# Altium project Reflow Oven Controller - Rev. A.PrjPcb
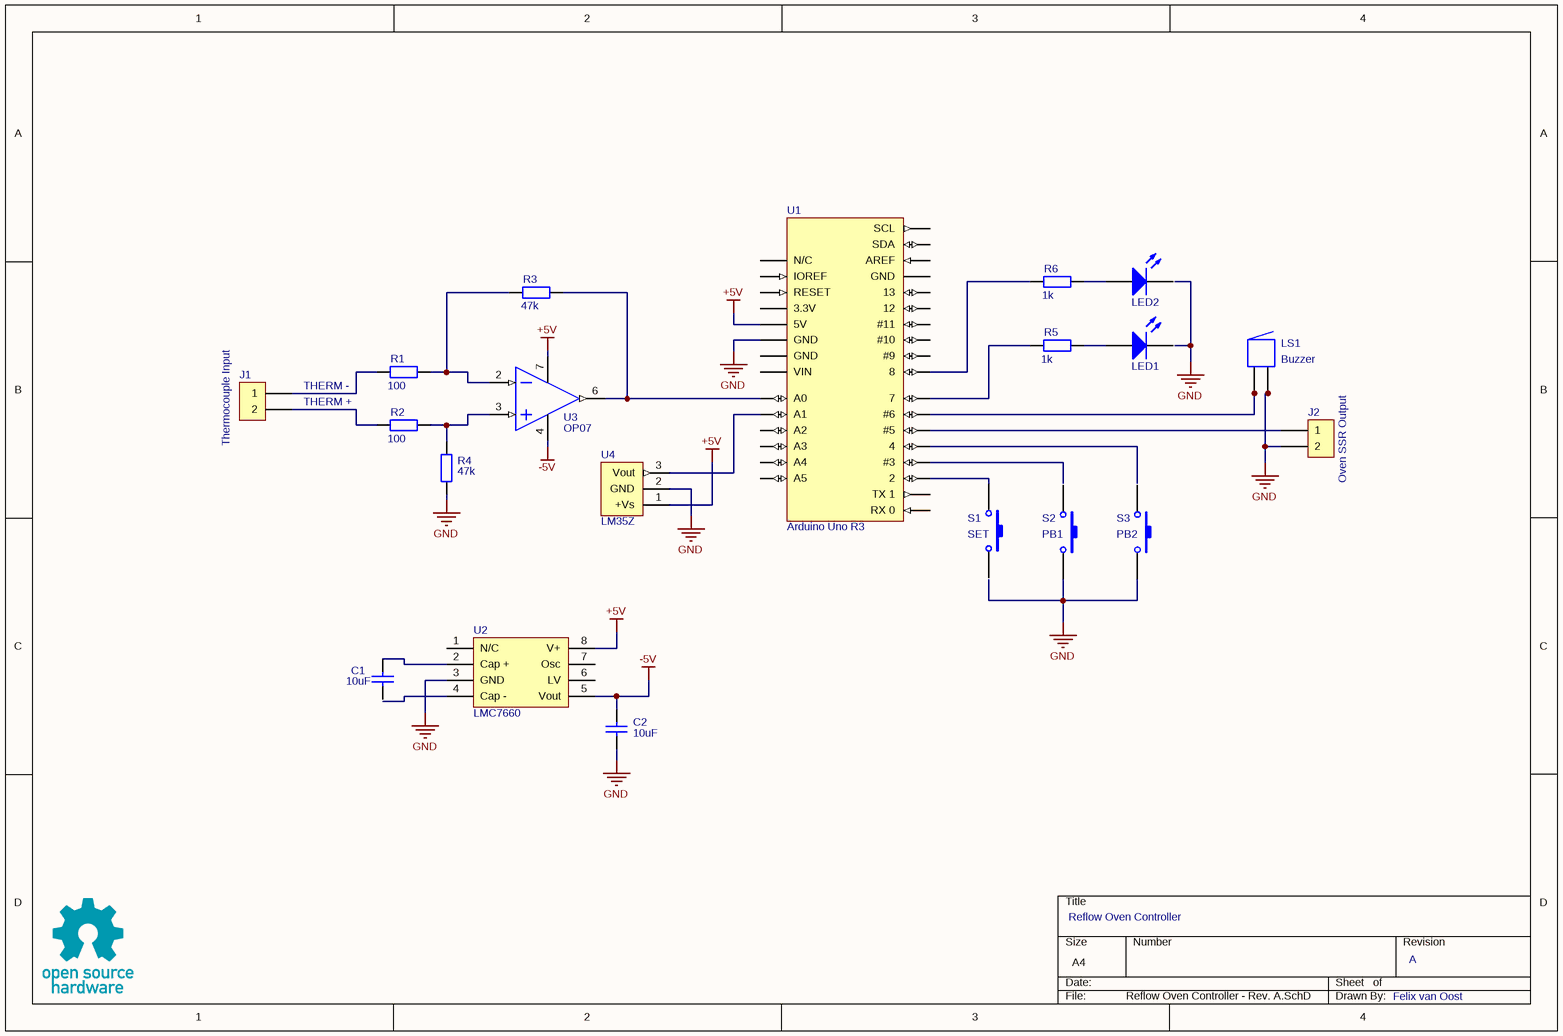
[diagram p0: Reflow Oven Controller - Rev. A.SchDoc]
1 sheet, 20 parts. Net scope: global (net labels, ports and power ports of the same name join across sheets).

## Sheet Reflow Oven Controller - Rev. A.SchDoc: Reflow Oven Controller
size A4; DrawnBy: Felix van Oost; Engineer: Felix van Oost; DocumentNumber: 1; Revision: A; ProjectName: Reflow Oven Controller

### Parts
C1  value 10uF  [RAD-0.3]
C2  value 10uF  [RAD-0.3]
D1  LED1  [LED-1]
D2  LED2  [LED-1]
J1  2-Pin Header  (value not drawn)
J2  2-Pin Header  (value not drawn)
LS1  Buzzer  [ABSM-1574]
R1  value 100  [AXIAL-0.4]
R2  value 100  [AXIAL-0.4]
R3  value 47k  [AXIAL-0.4]
R4  value 47k  [AXIAL-0.4]
R5  value 1k  [AXIAL-0.4]
R6  value 1k  [AXIAL-0.4]
S1  SET  [SPST-2]
S2  PB1  [SPST-2]
S3  PB2  [SPST-2]
U1  Arduino Uno R3
U2  LMC7660
U3  OP07
U4  LM35Z

### Nets
+5V: U1.5(5V) U2.8(V+) U3.7(V+) U4.1(+Vs)
-5V: C2.2 U2.5(Vout) U3.4(V-)
GND: C2.1 J2.2 LS1.2 LS1.2A R4.1 S2.2 S3.2 U1.6(GND) U2.3(GND) U4.2(GND)
NetC1_2: C1.2 U2.2(Cap_+)
NetD1_1: D1.1(A) R5.2
NetD2_1: D2.1(A) R6.2
NetJ1_1: J1.1 R1.1
NetJ1_2: J1.2 R2.1
NetJ2_1: J2.1 U1.20(#5)
NetLS1_1: LS1.1 LS1.1A U1.21(#6)
NetR1_2: R1.2 R3.1 U3.2(-In)
NetR2_2: R2.2 R4.2 U3.3(+In)
NetR3_2: R3.2 U1.9(A0) U3.6(OUT)
NetR5_1: R5.1 U1.22(7)
NetR6_1: R6.1 U1.23(8)
NetS1_1: S1.1 U1.17(2)
NetU1_10: U1.10(A1) U4.3(Vout)

Not connected (* = marked no-connect by the designer): C1 1; D1 2(K); D2 2(K); S1 2; S2 1; S3 1; U1 1(N/C) 2(IOREF) 3(RESET) 4(3.3V) 7(GND) 8(VIN) 11(A2) 12(A3) 13(A4) 14(A5) 15(RX_0) 16(TX_1) 18(#3) 19(4) 24(#9) 25(#10) 26(#11) 27(12) 28(13) 29(SCL); U2 1(N/C) 4(Cap_-) 6(LV) 7(Osc)

### Notes on the sheet
- (near J1) Thermocouple Input
- THERM -
- THERM +
- (near J2) Oven SSR Output

### Library data of the parts
C1 C2 = Cap: Capacitor; Published: 8-Jun-2000; LatestRevisionDate: 17-Jul-2002; LatestRevisionNote: Re-released for DXP Platform.; PackageReference: RAD-0.3; Publisher: Altium Limited; PackageDescription: Radial Cap, Thru-Hole; 2 Leads; 0.3 in Pin Spacing
D1 D2 = LED1: Typical RED GaAs LED; Published: 8-Jun-2000; LatestRevisionDate: 08-Jul-2005; LatestRevisionNote: Mech Layer 1 removed.; PackageReference: LED-1; Publisher: Altium Limited; PackageDescription: LED; 2 Leads
LS1 = Buzzer: Magnetic Transducer Buzzer; Published: 24-Mar-1999; LatestRevisionDate: 17-Dec-2003; LatestRevisionNote: Schematic revised, PCB Footprint replaced.; DatasheetVersion: 17-Dec-2003; PackageReference: ABSM-1574; Publisher: Altium Limited; PackageDescription: Magnetic Transducer Buzzer; ComponentLink1Description: Manufacturer Link; ComponentLink1URL: http://www.megastar.com/linecard/buzzmode/index.php
R1-R6 = Res2: Resistor; Published: 8-Jun-2000; LatestRevisionDate: 17-Jul-2002; LatestRevisionNote: Re-released for DXP Platform.; PackageReference: AXIAL-0.4; Publisher: Altium Limited; PackageDescription: Axial Device, Thru-Hole; 2 Leads; 0.4 in Pin Spacing
S1-S3 = SW-PB: Switch; Published: 24-Mar-1999; LatestRevisionDate: 17-Jul-2002; LatestRevisionNote: Re-released for DXP Platform.; PackageReference: SPST-2; Publisher: Altium Limited; PackageDescription: Switch; 2 Leads
U1 = Arduino Uno R3: Open-Source Prototyping Plaform
U2 = Texas Instruments LMC7660: Switched Capacitor Voltage Converter
U3 = Analog Devices OP07: Low Offset Op-Amp
U4 = Texas Instruments LM35Z: Celsius Temperature Sensor (TO-92)